# Altium schematic sheet PC_JTAGInterface.SchDoc: Payload Computer - JTAG & Boot Select
size A3; Engineer: Matt Brindley; Organization: BLUEsat Project; Address1: Room 419; Address2: School of EE&T; Address3: UNSW, NSW 2052; Address4: Australia
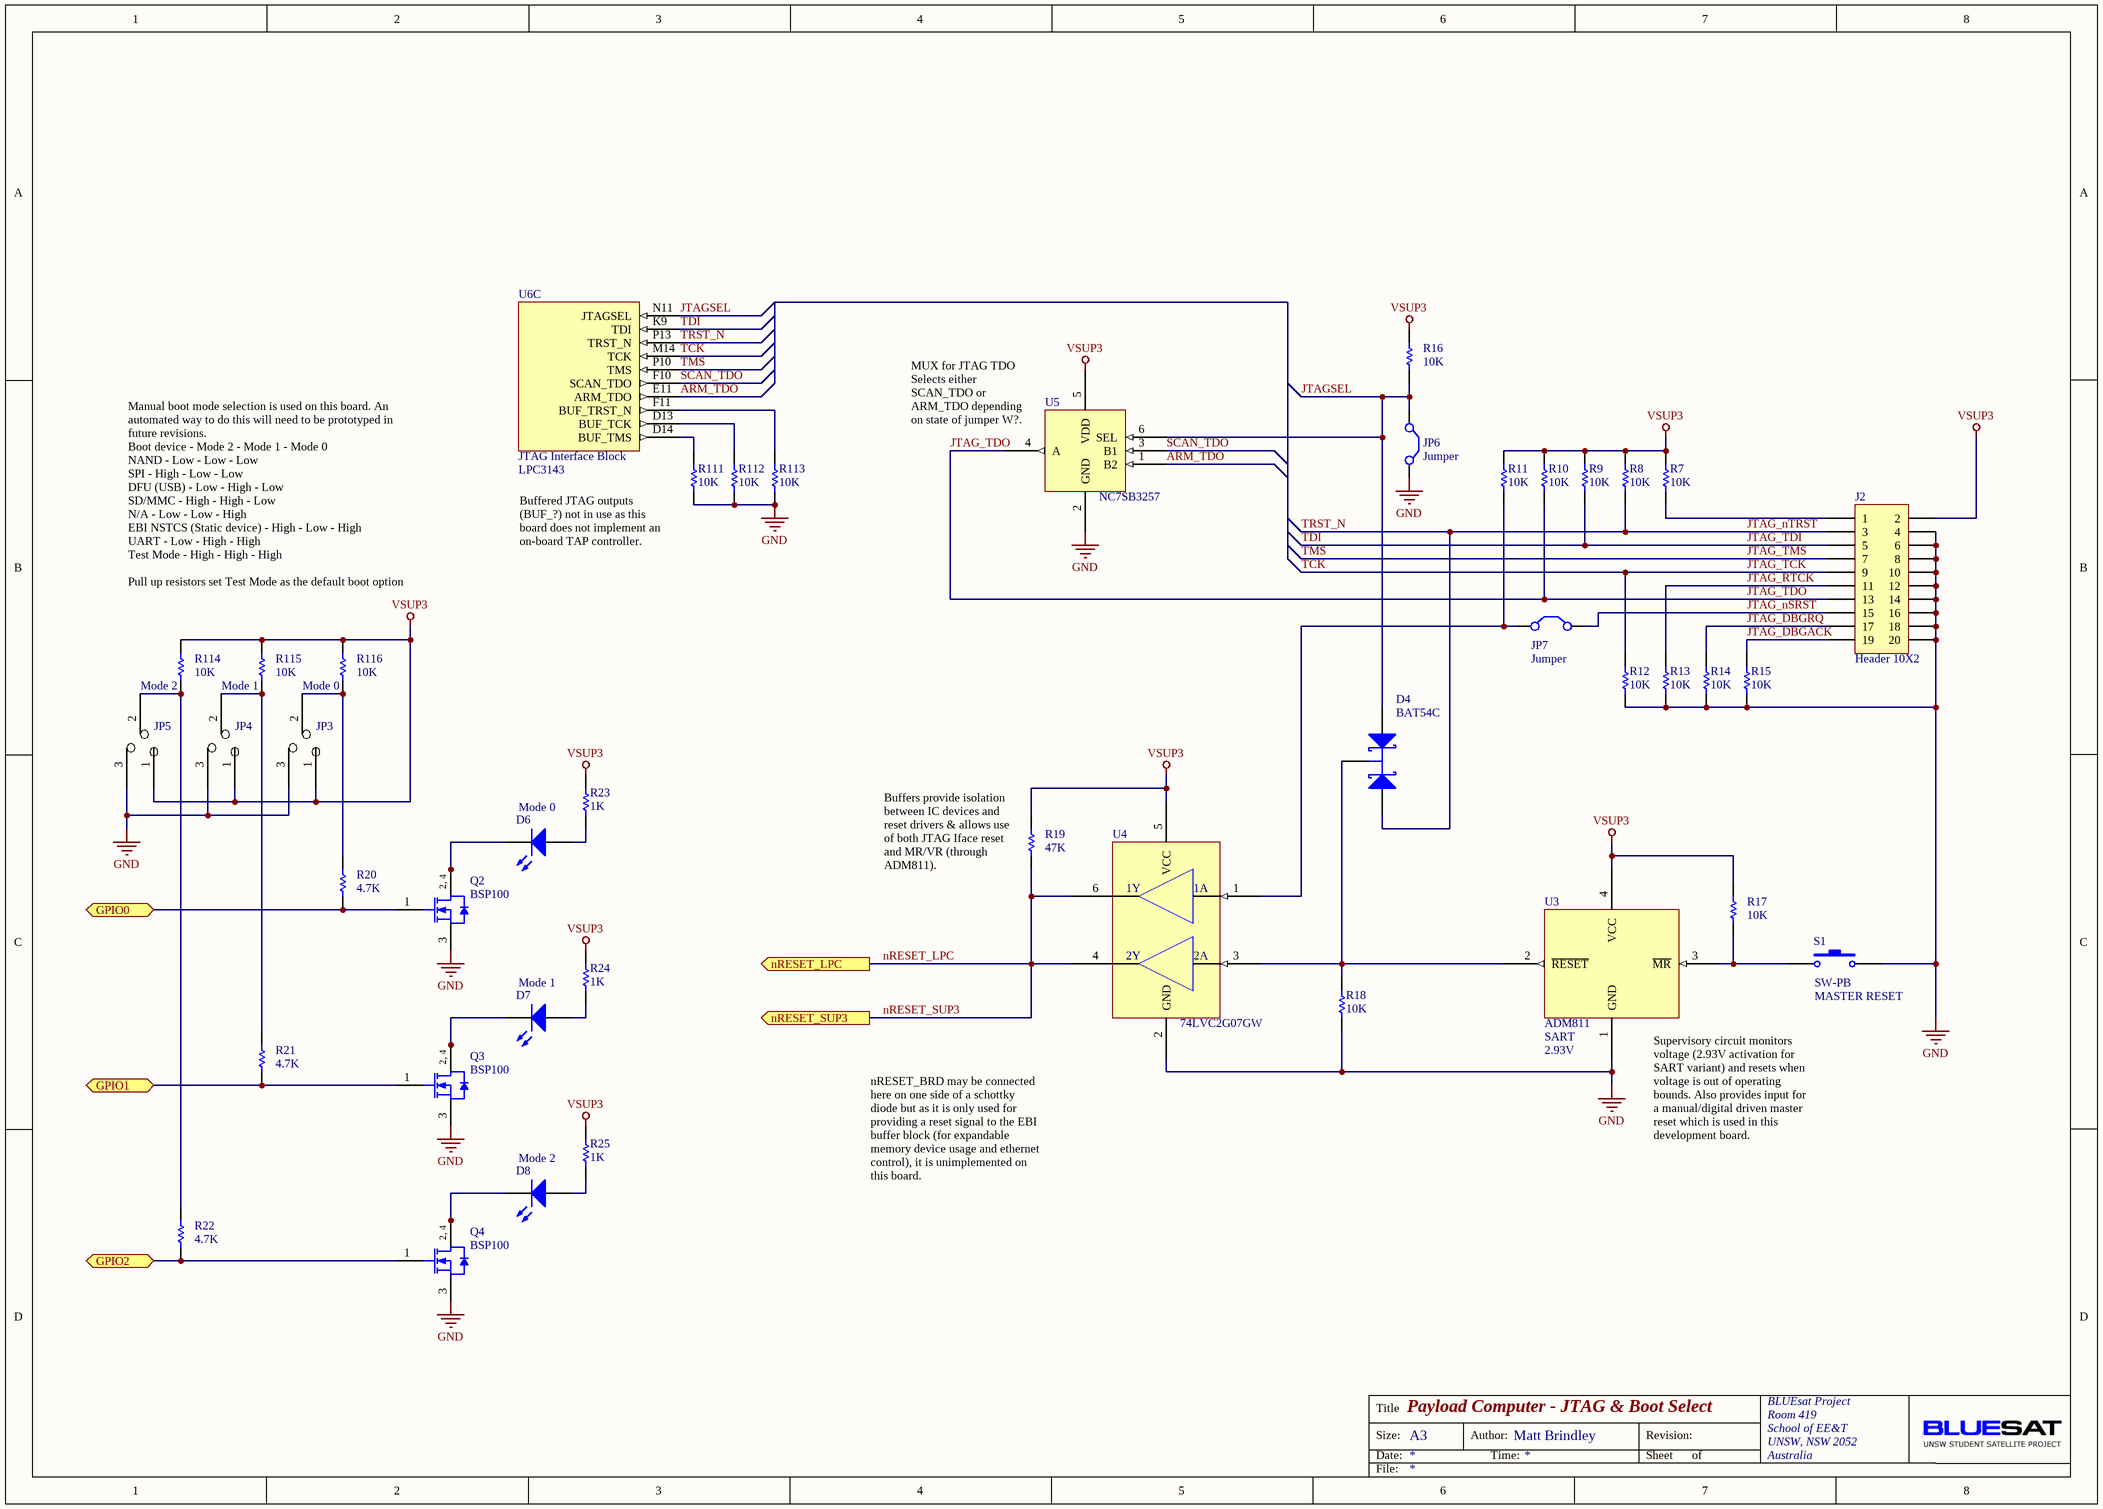
[diagram p0: PC_JTAGInterface.SchDoc]

## Parts
D4  BAT54C  [SOT23_N]
D6  LED2  [DSO-F2/D6.1]  (value not drawn)
D7  LED2  [DSO-F2/D6.1]  (value not drawn)
D8  LED2  [DSO-F2/D6.1]  (value not drawn)
J2  Header 10X2  [HDR2X10]
JP3  Jumper  [HDR1X3]  (value not drawn)
JP4  Jumper  [HDR1X3]  (value not drawn)
JP5  Jumper  [HDR1X3]  (value not drawn)
JP6  Jumper  [HDR1X2]
JP7  Jumper  [HDR1X2]
Q2  BSP100  [SOT223_N]
Q3  BSP100  [SOT223_N]
Q4  BSP100  [SOT223_N]
R7  value 10K  [6-0805_L]  (hidden comment: Res Semi)
R8  value 10K  [6-0805_L]  (hidden comment: Res Semi)
R9  value 10K  [6-0805_L]  (hidden comment: Res Semi)
R10  value 10K  [6-0805_L]  (hidden comment: Res Semi)
R11  value 10K  [6-0805_L]  (hidden comment: Res Semi)
R12  value 10K  [6-0805_L]  (hidden comment: Res Semi)
R13  value 10K  [6-0805_L]  (hidden comment: Res Semi)
R14  value 10K  [6-0805_L]  (hidden comment: Res Semi)
R15  value 10K  [6-0805_L]  (hidden comment: Res Semi)
R16  value 10K  [6-0805_L]  (hidden comment: Res Semi)
R17  value 10K  [6-0805_L]  (hidden comment: Res Semi)
R18  value 10K  [6-0805_L]  (hidden comment: Res Semi)
R19  value 47K  [6-0805_L]  (hidden comment: Res Semi)
R20  value 4.7K  [6-0805_L]  (hidden comment: Res Semi)
R21  value 4.7K  [6-0805_L]  (hidden comment: Res Semi)
R22  value 4.7K  [6-0805_L]  (hidden comment: Res Semi)
R23  value 1K  [6-0805_L]  (hidden comment: Res Semi)
R24  value 1K  [6-0805_L]  (hidden comment: Res Semi)
R25  value 1K  [6-0805_L]  (hidden comment: Res Semi)
R111  value 10K  [6-0805_L]  (hidden comment: Res Semi)
R112  value 10K  [6-0805_L]  (hidden comment: Res Semi)
R113  value 10K  [6-0805_L]  (hidden comment: Res Semi)
R114  value 10K  [6-0805_L]  (hidden comment: Res Semi)
R115  value 10K  [6-0805_L]  (hidden comment: Res Semi)
R116  value 10K  [6-0805_L]  (hidden comment: Res Semi)
S1  SW-PB  [SPST-2]
U3  ADM811  [SOT190P230X102-4N]
U4  74LVC2G07GW  [SOT65P210X110-6M]
U5  NC7SB3257  [TSOP65P210X110-6N]
U6  LPC3143  [BGA180C80P14X14_1200X1200X120]  (part C of 11)

## Ports
GPIO0 (bidir), GPIO1 (bidir), GPIO2 (bidir), nRESET_LPC (out), nRESET_SUP3 (out)

## Nets
GND: J2.4 J2.6 J2.8 J2.10 J2.12 J2.14 J2.16 J2.18 J2.20 JP3.3 JP4.3 JP5.3 JP6.2(C2) Q2.3(S) Q3.3(S) Q4.3(S) R12.1 R13.1 R14.1 R15.1 R18.1 R111.1 R112.1 R113.1 S1.2 U3.1(GND) U4.2(GND) U5.2(GND)
VSUP3: J2.2 JP3.1 JP4.1 JP5.1 R7.2 R8.2 R9.2 R10.2 R11.2 R16.2 R17.2 R19.2 R23.2 R24.2 R25.2 R114.2 R115.2 R116.2 U3.4(VCC) U4.5(VCC) U5.5(VDD)
ARM_TDO: U5.1(B2) U6.E11(ARM_TDO)
GPIO0: Q2.1(G) R20.1 ; port GPIO0
GPIO1: Q3.1(G) R21.1 ; port GPIO1
GPIO2: Q4.1(G) R22.1 ; port GPIO2
JTAG_DBGACK: J2.19 R15.2
JTAG_DBGRQ: J2.17 R14.2
JTAG_nSRST: J2.15 JP7.2(C2)
JTAG_nTRST: D4.1(A1) J2.3 R8.1 U6.P13(TRST_N)  [also labelled TRST_N]
JTAG_RTCK: J2.11 R13.2
JTAG_TCK: J2.9 R12.2 U6.M14(TCK)  [also labelled TCK]
JTAG_TDI: J2.5 R9.1 U6.K9(TDI)  [also labelled TDI]
JTAG_TDO: J2.13 R10.1 U5.4(A)
JTAG_TMS: J2.7 U6.P10(TMS)  [also labelled TMS]
JTAGSEL: D4.2(A2) JP6.1(C1) R16.1 U5.6(SEL) U6.N11(JTAGSEL)
nRESET_LPC: R19.1 U4.4(2Y) U4.6(1Y) ; port nRESET_LPC, port nRESET_SUP3  [also labelled nRESET_SUP3]
SCAN_TDO: U5.3(B1) U6.F10(SCAN_TDO)
NetD4_3: D4.3(K) R18.2 U3.2(~{RESET}) U4.3(2A)
NetD6_1: D6.1(A) R23.1
NetD6_2: D6.2(K) Q2.2(D) Q2.4(D)
NetD7_1: D7.1(A) R24.1
NetD7_2: D7.2(K) Q3.2(D) Q3.4(D)
NetD8_1: D8.1(A) R25.1
NetD8_2: D8.2(K) Q4.2(D) Q4.4(D)
NetJ2_1: J2.1 R7.1
NetJP3_2: JP3.2 R20.2 R116.1
NetJP4_2: JP4.2 R21.2 R115.1
NetJP5_2: JP5.2 R22.2 R114.1
NetJP7_1: JP7.1(C1) R11.1 U4.1(1A)
NetR17_1: R17.1 S1.1 U3.3(~{MR})
NetR111_2: R111.2 U6.D14(BUF_TMS)
NetR112_2: R112.2 U6.D13(BUF_TCK)
NetR113_2: R113.2 U6.F11(BUF_TRST_N)

## Notes on the sheet
- (near U5) MUX for JTAG TDO
  Selects either SCAN_TDO or ARM_TDO depending on state of jumper W?.
- (near R111) Buffered JTAG outputs (BUF_?) not in use as this board does not implement an on-board TAP controller.
- Manual boot mode selection is used on this board. An automated way to do this will need to be prototyped in future revisions.
  Boot device - Mode 2 - Mode 1 - Mode 0
  NAND - Low - Low - Low
  SPI - High - Low - Low
  DFU (USB) - Low - High - Low
  SD/MMC - High - High - Low
  N/A - Low - Low - High
  EBI NSTCS (Static device) - High - Low - High
  UART - Low - High - High
  Test Mode - High - High - High
  Pull up resistors set Test Mode as the default boot option
- (near R114) Mode 2
- (near R115) Mode 1
- (near R116) Mode 0
- Mode 0
- (near R19) Buffers provide isolation between IC devices and reset drivers & allows use of both JTAG Iface reset and MR/VR (through ADM811).
- Mode 1
- (near U3) SART
- (near U3) 2.93V
- (near S1) MASTER RESET
- Mode 2
- nRESET_BRD may be connected here on one side of a schottky diode but as it is only used for providing a reset signal to the EBI buffer block (for expandable memory device usage and ethernet control), it is unimplemented on this board.
- (near U3) Supervisory circuit monitors voltage (2.93V activation for SART variant) and resets when voltage is out of operating bounds. Also provides input for a manual/digital driven master reset which is used in this development board.
- Title
- Size:
- Date:
- A3
- Author:
- Time:
- Revision:
- Sheet
- of
- File:
- (in symbol BSP100) 2, 4
- (in symbol LPC3143, part C) JTAG Interface Block

## Library data of the parts
D4 = BAT54C: Schottky Barrier Double Diode; Published: 17-Sep-2003; LatestRevisionDate: 12-Dec-2006; LatestRevisionNote: IPC-7351 Footprint Added.; DatasheetVersion: 4-Mar-2002; PackageVersion: May-1999; PackageReference: SOT23; Publisher: Altium Limited; PackageDescription: 3-Pin SOT-23 Package 0.95 mm Pitch, 2.3 mm Lead Span; ComponentLink1Description: Manufacturer Link; ComponentLink1URL: http://www.semiconductors.philips.com/; ComponentLink2Description: Datasheet; ComponentLink2URL: http://www.semiconductors.philips.com/acrobat/datasheets/BAT54_SERIES_4.pdf
D6-D8 = LED2: Typical RED, GREEN, YELLOW, AMBER GaAs LED; Published: 8-Jun-2000; LatestRevisionDate: 17-Jul-2002; LatestRevisionNote: Re-released for DXP Platform.; PackageVersion: Feb-2002; PackageReference: 3.2X1.6X1.1; Publisher: Altium Limited
J2 = Header 10X2: Header, 10-Pin, Dual row; LatestRevisionDate: 17-Jul-2002; LatestRevisionNote: Re-released for DXP Platform.; Publisher: Altium Limited
JP3-JP5 = 2 position jumper: 3 pin jumper for selection; Published: 8-Jun-2000; LatestRevisionDate: 08-Jul-2005; LatestRevisionNote: Mech Layer 1 removed.; PackageReference: LED-0; Publisher: Altium Limited
JP6 JP7 = Jumper: Jumper Wire; Published: 24-Mar-1999; LatestRevisionDate: 17-Jul-2002; LatestRevisionNote: Re-released for DXP Platform.; PackageReference: RAD-0.2; Publisher: Altium Limited
Q2-Q4 = BSP100: N-channel Enhancement Mode MOSFET; Published: 17-Sep-2003; LatestRevisionDate: 12-Dec-2006; LatestRevisionNote: IPC-7351 Footprint Added.; DatasheetVersion: Feb-1999; PackageVersion: Aug-2001; PackageReference: SOT223; Publisher: Altium Limited; PackageDescription: 4-Pin SOT-223 Package 2.3 mm Pitch, 7 mm Lead Span; ComponentLink1Description: Manufacturer Link; ComponentLink1URL: http://www.semiconductors.philips.com/; ComponentLink2Description: Datasheet; ComponentLink2URL: http://www.semiconductors.philips.com/acrobat/datasheets/BSP100_3.pdf
R7-R25 R111-R116 = Res Semi: Semiconductor Resistor; Published: 8-Jun-2000; LatestRevisionDate: 17-Jul-2002; LatestRevisionNote: Re-released for DXP Platform.; PackageReference: AXIAL-0.5; Publisher: Altium Limited
S1 = SW-PB: Switch; Published: 24-Mar-1999; LatestRevisionDate: 17-Jul-2002; LatestRevisionNote: Re-released for DXP Platform.; PackageReference: SPST-2; Publisher: Altium Limited
U3 = ADM811: Supervisory Circuit; Published: 8-Jun-2000; LatestRevisionDate: 08-Jul-2005; LatestRevisionNote: Mech Layer 1 removed.; PackageReference: LED-0; Publisher: Altium Limited
U4 = 74LVC2G07GW: Non-inverting buffers with open-drain outputs; Published: 8-Jun-2000; LatestRevisionDate: 08-Jul-2005; LatestRevisionNote: Mech Layer 1 removed.; PackageReference: LED-0; Publisher: Altium Limited
U5 = NC7SB3257: 2:1 Mux, Fairchild; Published: 8-Jun-2000; LatestRevisionDate: 08-Jul-2005; LatestRevisionNote: Mech Layer 1 removed.; PackageReference: LED-0; Publisher: Altium Limited
U6 = LPC3143: NXP ARM9 based microcontroller; Published: N/A; LatestRevisionDate: 09/03/2010; LatestRevisionNote: Created; PackageReference: BGA; Publisher: BLUEsat Project